# EAGLE design usbuartLayout (EAGLE 6.0)
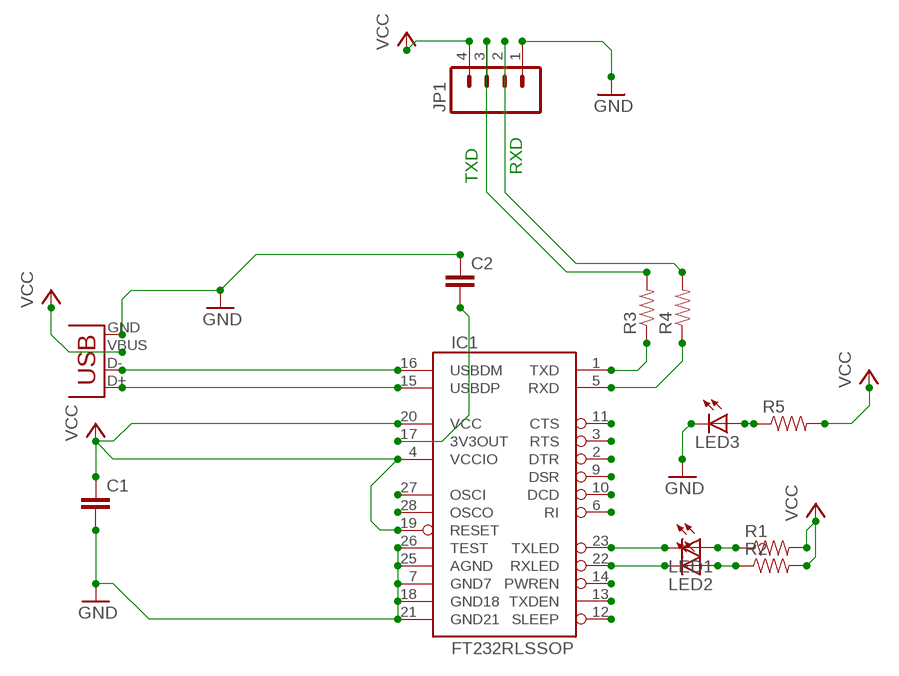
[diagram p0: schematic, sheet 1]

## Parts
C1  CAP1206  [1206]
C2  CAP1206  [1206]
IC1  FT232RLSSOP  [SSOP28DB]
JP1  M04SMD  [1X04-SMD]
LED1  LEDCHIPLED_1206  [CHIPLED_1206]
LED2  LEDCHIPLED_1206  [CHIPLED_1206]
LED3  LEDCHIPLED_1206  [CHIPLED_1206]
R1  RESISTOR1206  [1206]
R2  RESISTOR1206  [1206]
R3  RESISTOR1206  [1206]
R4  RESISTOR1206  [1206]
R5  RESISTOR1206  [1206]
X1  USB-SMD-NS  [USB-MINIB-NOSTOP]

## Nets
GND: C1.2 C2.1 IC1.7(GND7) IC1.18(GND18) IC1.21(GND21) IC1.25(AGND) IC1.26(TEST) JP1.1 LED3.C X1.GND
N$1: IC1.1(TXD) R3.1
N$2: JP1.3 R3.2
N$5: IC1.15(USBDP) X1.D+
N$6: IC1.16(USBDM) X1.D-
N$7: LED3.A R5.1
N$8: C2.2 IC1.17(3V3OUT)
N$9: IC1.5(RXD) R4.1
N$10: IC1.27(OSCI)
N$11: IC1.28(OSCO)
N$12: JP1.2 R4.2
N$18: IC1.12(SLEEP)
N$19: IC1.13(TXDEN)
N$20: IC1.14(PWREN)
N$21: IC1.22(RXLED) LED2.C
N$22: IC1.23(TXLED) LED1.C
N$23: IC1.6(RI)
N$24: IC1.10(DCD)
N$25: IC1.9(DSR)
N$26: IC1.2(DTR)
N$27: IC1.3(RTS)
N$28: IC1.11(CTS)
N$39: LED2.A R2.1
N$40: LED1.A R1.1
VCC: C1.1 IC1.4(VCCIO) IC1.19(RESET) IC1.20(VCC) JP1.4 R1.2 R2.2 R5.2 X1.VBUS

## Notes on the sheet
- RXD
- TXD

## Library data of the parts
C1 C2 = SparkFun-Capacitors:CAP: Capacitor Standard 0603 ceramic capacitor, and 0.1" leaded capacitor.
IC1 = SparkFun-DigitalIC:FT232RL: USB UART FT232RL 4th Generation USB UART (USB <-> Serial) Controller. Spark Fun Electronics SKU : COM-00650 Production SKU IC-00870; PROD_ID: IC-00870
JP1 = SparkFun-Connectors:M04: Header 4 Standard 4-pin 0.1" header. Use with straight break away headers (SKU : PRT-00116), right angle break away headers (PRT-00553), swiss pins (PRT-00743), machine pins (PRT-00117), and female headers (PRT-00115). Molex polarized connector foot print use with SKU : PRT-08231 with associated crimp pins and housings. 1MM SMD Version SKU: PRT-10208
LED1-LED3 = led:LED: LED OSRAM: - CHIPLED LG R971, LG N971, LY N971, LG Q971, LY Q971, LO R971, LY R971 LH N974, LH R974 LS Q976, LO Q976, LY Q976 LO Q996 - Hyper CHIPLED LW Q18S LB Q993, LB Q99A, LB R99A - SideLED LS A670, LO A670, LY A670, LG A670, LP A670 LB A673, LV A673, LT A673, LW A673 LH A674 LY A675 LS A676, LA A676, LO A676, LY A676, LW A676 LS A679, LY A679, LG A679 - Hyper Micro SIDELED® LS Y876, LA Y876, LO Y876, LY Y876 LT Y87S - SmartLED LW L88C, LW L88S LB L89C, LB L89S, LG L890 LS L89K, LO L89K, LY L89K LS L896, LA L896, LO L896, LY L896 - TOPLED LS T670, LO T670, LY T670, LG T670, LP T670 LSG T670, LSP T670, LSY T670, LOP T670, LYG T670 LG T671, LOG T671, LSG T671 LB T673, LV T673, LT T673, LW T673 LH T674 LS T676, LA T676, LO T676, LY T676, LB T676, LH T676, LSB T676, LW T676 LB T67C, LV T67C, LT T67C, LS T67K, LO T67K, LY T67K, LW E67C LS E67B, LA E67B, LO E67B, LY E67B, LB E67C, LV E67C, LT E67C LW T67C LS T679, LY T679, LG T679 LS T770, LO T770, LY T770, LG T770, LP T770 LB T773, LV T773, LT T773, LW T773 LH T774 LS E675, LA E675, LY E675, LS T675 LS T776, LA T776, LO T776, LY T776, LB T776 LHGB T686 LT T68C, LB T68C - Hyper Mini TOPLED® LB M676 - Mini TOPLED Santana® LG M470 LS M47K, LO M47K, LY M47K Source: http://www.osram.convergy.de LUXEON: - LUMILED® LXK2-PW12-R00, LXK2-PW12-S00, LXK2-PW14-U00, LXK2-PW14-V00 LXK2-PM12-R00, LXK2-PM12-S00, LXK2-PM14-U00 LXK2-PE12-Q00, LXK2-PE12-R00, LXK2-PE12-S00, LXK2-PE14-T00, LXK2-PE14-U00 LXK2-PB12-K00, LXK2-PB12-L00, LXK2-PB12-M00, LXK2-PB14-N00, LXK2-PB14-P00, LXK2-PB14-Q00 LXK2-PR12-L00, LXK2-PR12-M00, LXK2-PR14-Q00, LXK2-PR14-R00 LXK2-PD12-Q00, LXK2-PD12-R00, LXK2-PD12-S00 LXK2-PH12-R00, LXK2-PH12-S00 LXK2-PL12-P00, LXK2-PL12-Q00, LXK2-PL12-R00 Source: www.luxeon.com KINGBRIGHT: KA-3528ASYC Source: www.kingbright.com
R1-R5 = SparkFun-Resistors:RESISTOR: Resistor Basic schematic elements and footprints for 0603, 1206, and PTH resistors.
X1 = SparkFun-Connectors:USB: USB Connectors USB-B-PTH is fully proven SKU : PRT-00139/CONN-08278 USB-miniB is fully proven SKU : PRT-00587 USB-A-PCB is untested. USB-A-H is throughly reviewed, but untested. Spark Fun Electronics SKU : PRT-00437 USB-B-SMT is throughly reviewed, but untested. Needs silkscreen touching up. USB-A-S has not been used/tested USB-MB-H has not been used/tested USB-MICROB has been used. CONN-09505

## Board
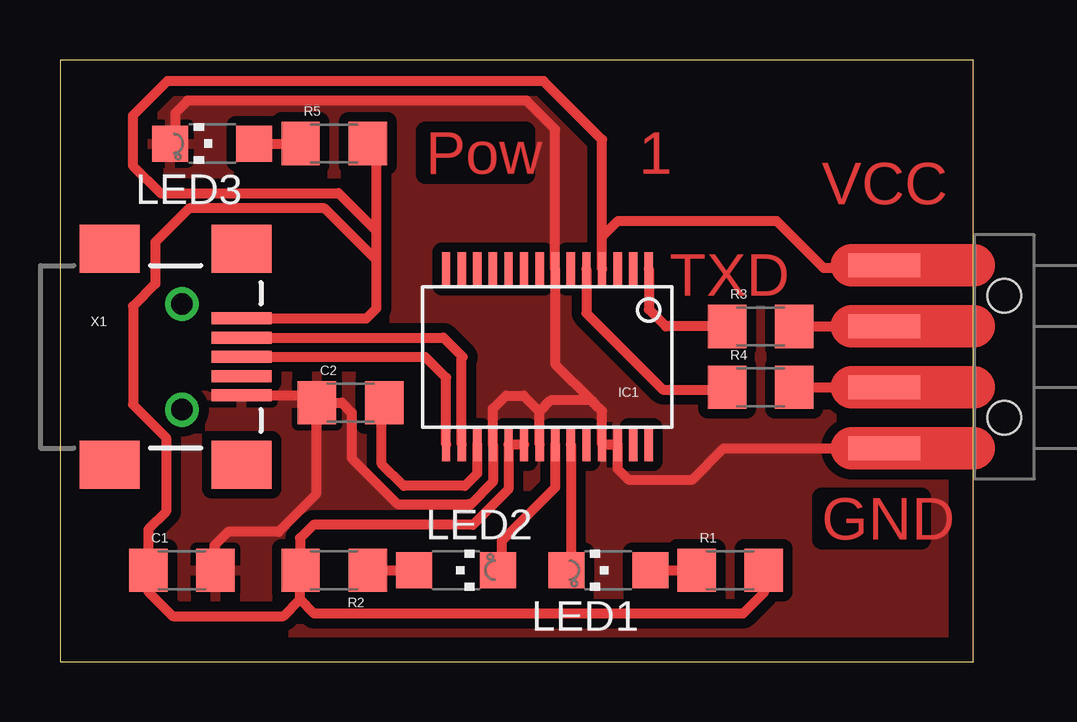
[diagram p1: board, top side]

Size 38.08 x 25.07 mm. Coordinates in mm from the lower left corner, seen from the top.
Outline: 0,0 38.08,0 38.08,25.07 0,25.07 0,0
Copper layers (1*16): Top 0.035mm / dielectric 1.5mm / Bottom 0.035mm
Design rules: minimum track width 10mil, minimum drill 24mil, track to track 8mil, track to pad 8mil, pad to pad 8mil, via to via 8mil, smd to smd 8mil, copper to edge 40mil, drill to drill 8mil, minimum pad ring 10mil, minimum via ring 8mil, stop-mask expansion 4mil, vias tented up to drill 0mil, thermal gap 10mil

### Footprints (pad centres in the part's own frame; a part is rotated, then mirrored left to right if it is on the bottom)
1206 = smd 1.6 x 1.8: 1 -1.4,0; 2 1.4,0
SSOP28DB = smd 0.348 x 1.397: 1 -4.225,-3.656; 2 -3.575,-3.656; 3 -2.925,-3.656; 4 -2.275,-3.656; 5 -1.625,-3.656; 6 -0.975,-3.656; 7 -0.325,-3.656; 8 0.325,-3.656; 9 0.975,-3.656; 10 1.625,-3.656; 11 2.275,-3.656; 12 2.925,-3.656; 13 3.575,-3.656; 14 4.225,-3.656; 15 4.225,3.656; 16 3.575,3.656; 17 2.925,3.656; 18 2.275,3.656; 19 1.625,3.656; 20 0.975,3.656; 21 0.325,3.656; 22 -0.325,3.656; 23 -0.975,3.656; 24 -1.625,3.656; 25 -2.275,3.656; 26 -2.925,3.656; 27 -3.575,3.656; 28 -4.225,3.656
1X04-SMD = smd 1 x 3: 1 -3.81,5; 2 -1.27,5; 3 1.27,5; 4 3.81,5 | hole 1.4: -2.54,0; 2.54,0
CHIPLED_1206 = smd 1.5 x 1.5: A 0,-1.75; C 0,1.75
USB-MINIB-NOSTOP = smd 2.5 x 0.5: D+ 2.5,0; D- 2.5,0.8; GND 2.5,-1.6; ID 2.5,-0.8; VBUS 2.5,1.6 | smd 2.5 x 2: G1 -3,-4.5; G2 -3,4.5; G3 2.5,4.5; G4 2.5,-4.5 | drill 0.9 pad 0.8: H1 0,2.2 | drill 0.9 pad 0.787: H2 0,-2.2

### Placement (x,y rotation side)
C1  5.08,3.81 0 top
C2  12.11,10.79 0 top
IC1  20.32,12.7 180 top
JP1  39.37,12.7 90 top
LED1  22.86,3.81 90 top
LED2  16.51,3.81 270 top
LED3  6.35,21.59 90 top
R1  27.94,3.81 0 top
R2  11.43,3.81 180 top
R3  29.21,13.97 0 top
R4  29.21,11.43 0 top
R5  11.43,21.59 0 top
X1  5.08,12.7 0 top

### Tracks (layer width: path | path; a pad name or v marks a point on that pad's centre or on a via)
GND
  Top 0.406: JP1.1 27.66,8.88 26.37,7.58 23.7,7.58 23.25,8.04 IC1.26 IC1.25 22.59,10.45 22.31,10.73 22.16,10.88 | 22.16,10.88 20.46,10.88 20,10.42 | IC1.21 20,10.42 | 20,10.42 19.33,11.09 18.59,11.09 18.05,10.54 IC1.18 18.05,7.49 17.08,6.53 17.04,6.57 14.08,6.57 12.17,8.48 12.17,10.38 11.75,10.79 C2.1 10.4,11.1 X1.GND 10.53,11.1 10.68,10.96 10.68,6.97 9.12,5.41 7.01,5.41 6.43,4.83 6.43,3.86 C1.2 | LED3.C 4.81,21.8 4.81,22.86 5.32,23.37 19.45,23.37 20.64,22.18 IC1.7 20.64,12.4 22.16,10.88
  pour Top (isolate 0.406): 0,25.4 0,0 38.1,0 38.1,25.4
N$1
  Top 0.406: R3.1 25.26,13.97 24.55,14.68 IC1.1
N$2
  Top 0.406: R3.2 33.02,13.97 JP1.3
  Top 1.778: 33.02,13.97 38.1,13.97
N$3
  Top 1.778: 33.02,16.51 38.1,16.51
N$4
  Top 1.778: 33.02,8.89 38.1,8.89
N$5
  Top 0.406: X1.D+ 15.23,12.7 16.09,11.83 IC1.15
N$6
  Top 0.406: X1.D- 15.98,13.5 16.79,12.69 16.75,12.64 IC1.16
N$7
  Top 0.406: LED3.A R5.1
N$8
  Top 0.406: IC1.17 17.39,7.84 16.88,7.33 14.32,7.33 13.41,8.23 13.41,10.69 C2.2
N$9
  Top 0.406: IC1.5 21.95,14.52 25.13,11.33 27.71,11.33 R4.1
N$12
  Top 0.406: R4.2 33.02,11.43 JP1.2
  Top 1.778: 33.02,11.43 38.1,11.43
N$21
  Top 0.406: IC1.22 20.64,7.25 18.42,5.02 18.42,3.97 LED2.C
N$22
  Top 0.406: IC1.23 21.3,4 LED1.C
N$39
  Top 0.406: R2.1 LED2.A
N$40
  Top 0.406: LED1.A R1.1
VCC
  Top 0.406: JP1.4 34.27,16.41 31.83,16.41 29.87,18.37 23.26,18.37 22.59,17.7 IC1.4 22.59,21.75 20.16,24.19 4.47,24.19 3.04,22.75 3.04,20.67 4.19,19.52 11.61,19.52 13.19,17.94 | 10.01,2.59 9.31,1.9 4.7,1.9 3.68,2.91 C1.1 3.69,5.52 4.42,6.25 4.42,9.33 3.04,10.71 3.04,14.82 3.97,15.75 3.97,17.48 5.38,18.89 11.02,18.89 13.19,16.72 | 10.01,2.59 10.01,3.79 R2.2 10.01,3.83 10.01,5.14 10.56,5.7 17.21,5.7 18.7,7.18 IC1.19 IC1.20 | R1.2 29.34,2.87 28.48,2 10.6,2 10.01,2.59 | X1.VBUS 12.77,14.3 13.19,14.72 13.19,16.72 | 13.19,16.72 13.19,17.94 | 13.19,17.94 13.19,21.23 R5.2

### Text on the board
Top: Pow | 1 | VCC | TXD | GND